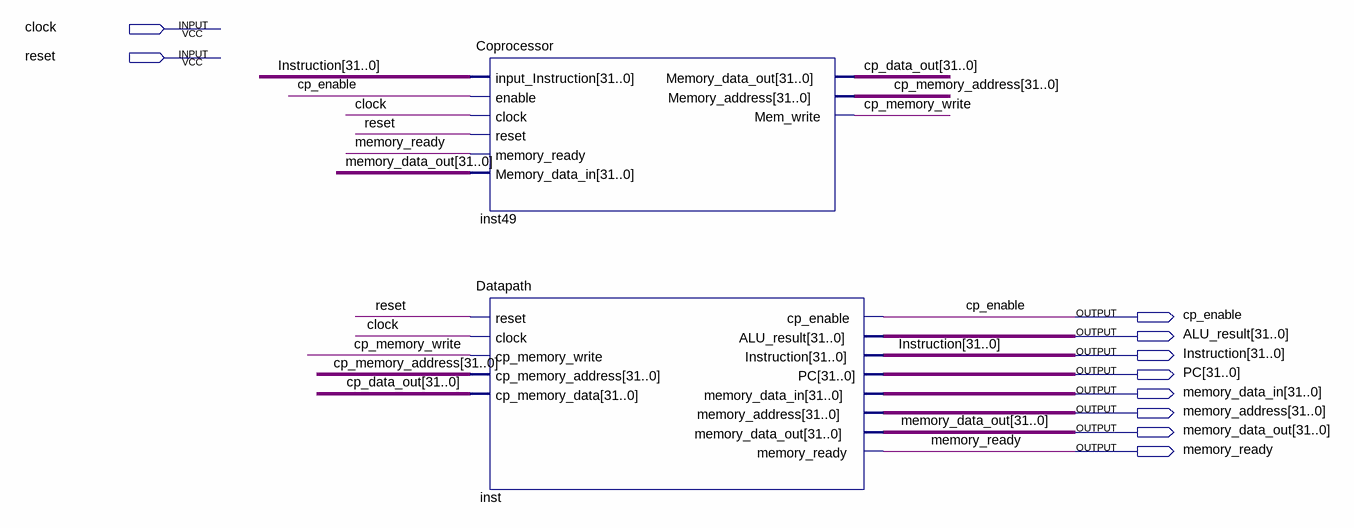
[diagram p0: schematic sheet]
// Quartus schematic device.bdf as structural Verilog: 2 symbols, 10 pins
module device (
  input  clock,
  input  reset,
  output cp_enable,
  output [31:0] ALU_result,
  output [31:0] Instruction,
  output [31:0] PC,
  output [31:0] memory_data_in,
  output [31:0] memory_address,
  output [31:0] memory_data_out,
  output memory_ready
);

  wire cp_memory_write;
  wire [31:0] cp_data_out, cp_memory_address;

  Coprocessor inst49 (
    .input_Instruction(Instruction), .enable(cp_enable), .clock(clock), .reset(reset),
    .memory_ready(memory_ready), .Memory_data_in(memory_data_out), .Memory_data_out(cp_data_out),
    .Memory_address(cp_memory_address), .Mem_write(cp_memory_write));
  Datapath inst (
    .reset(reset), .clock(clock), .cp_memory_write(cp_memory_write), .cp_memory_address(cp_memory_address),
    .cp_memory_data(cp_data_out), .cp_enable(cp_enable), .ALU_result(ALU_result), .Instruction(Instruction),
    .PC(PC), .memory_data_in(memory_data_in), .memory_address(memory_address),
    .memory_data_out(memory_data_out), .memory_ready(memory_ready));
endmodule
